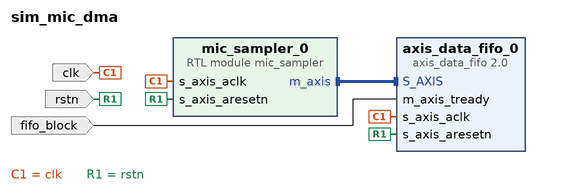
[diagram p0: block diagram of the top level]
# Vivado block design sim_mic_dma, xc7z020clg400-1, Vivado 2025.1
create_bd_design sim_mic_dma

create_bd_port -dir I -type rst rstn
create_bd_port -dir I -type clk clk
set_property -dict {CONFIG.FREQ_HZ 100000000} [get_bd_ports clk]
create_bd_port -dir I fifo_block

create_bd_cell -type ip -vlnv xilinx.com:ip:axis_data_fifo:2.0 axis_data_fifo_0
set_property -dict [list \
  CONFIG.FIFO_DEPTH 256 \
  CONFIG.FIFO_MEMORY_TYPE auto \
  CONFIG.HAS_PROG_FULL 1 \
  CONFIG.HAS_WR_DATA_COUNT 1 \
  CONFIG.PROG_FULL_THRESH 202 \
] [get_bd_cells axis_data_fifo_0]
create_bd_cell -type module -reference mic_sampler mic_sampler_0

# ---- connections ----

connect_bd_intf_net [get_bd_intf_pins mic_sampler_0/m_axis] [get_bd_intf_pins axis_data_fifo_0/S_AXIS]
connect_bd_net -net clk_wiz_clk_out1 [get_bd_ports clk] [get_bd_pins axis_data_fifo_0/s_axis_aclk] [get_bd_pins mic_sampler_0/s_axis_aclk]
connect_bd_net [get_bd_ports fifo_block] [get_bd_pins axis_data_fifo_0/m_axis_tready]
connect_bd_net -net rst_clk_wiz_100M_peripheral_aresetn [get_bd_ports rstn] \
  [get_bd_pins axis_data_fifo_0/s_axis_aresetn] [get_bd_pins mic_sampler_0/s_axis_aresetn]

validate_bd_design
save_bd_design
